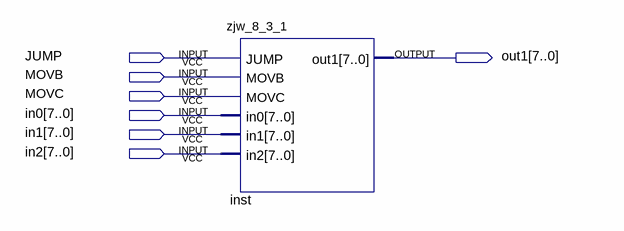
[diagram p0: schematic sheet]
// Quartus schematic Block1.bdf as structural Verilog: 1 symbols, 7 pins
module Block1 (
  input  JUMP,
  input  MOVB,
  input  MOVC,
  input  [7:0] in0,
  input  [7:0] in1,
  input  [7:0] in2,
  output [7:0] out1
);

  zjw_8_3_1 inst (.JUMP(JUMP), .MOVB(MOVB), .MOVC(MOVC), .in0(in0), .in1(in1), .in2(in2), .out1(out1));
endmodule
